# Altium schematic sheet STM32F107_207.SchDoc
size A4
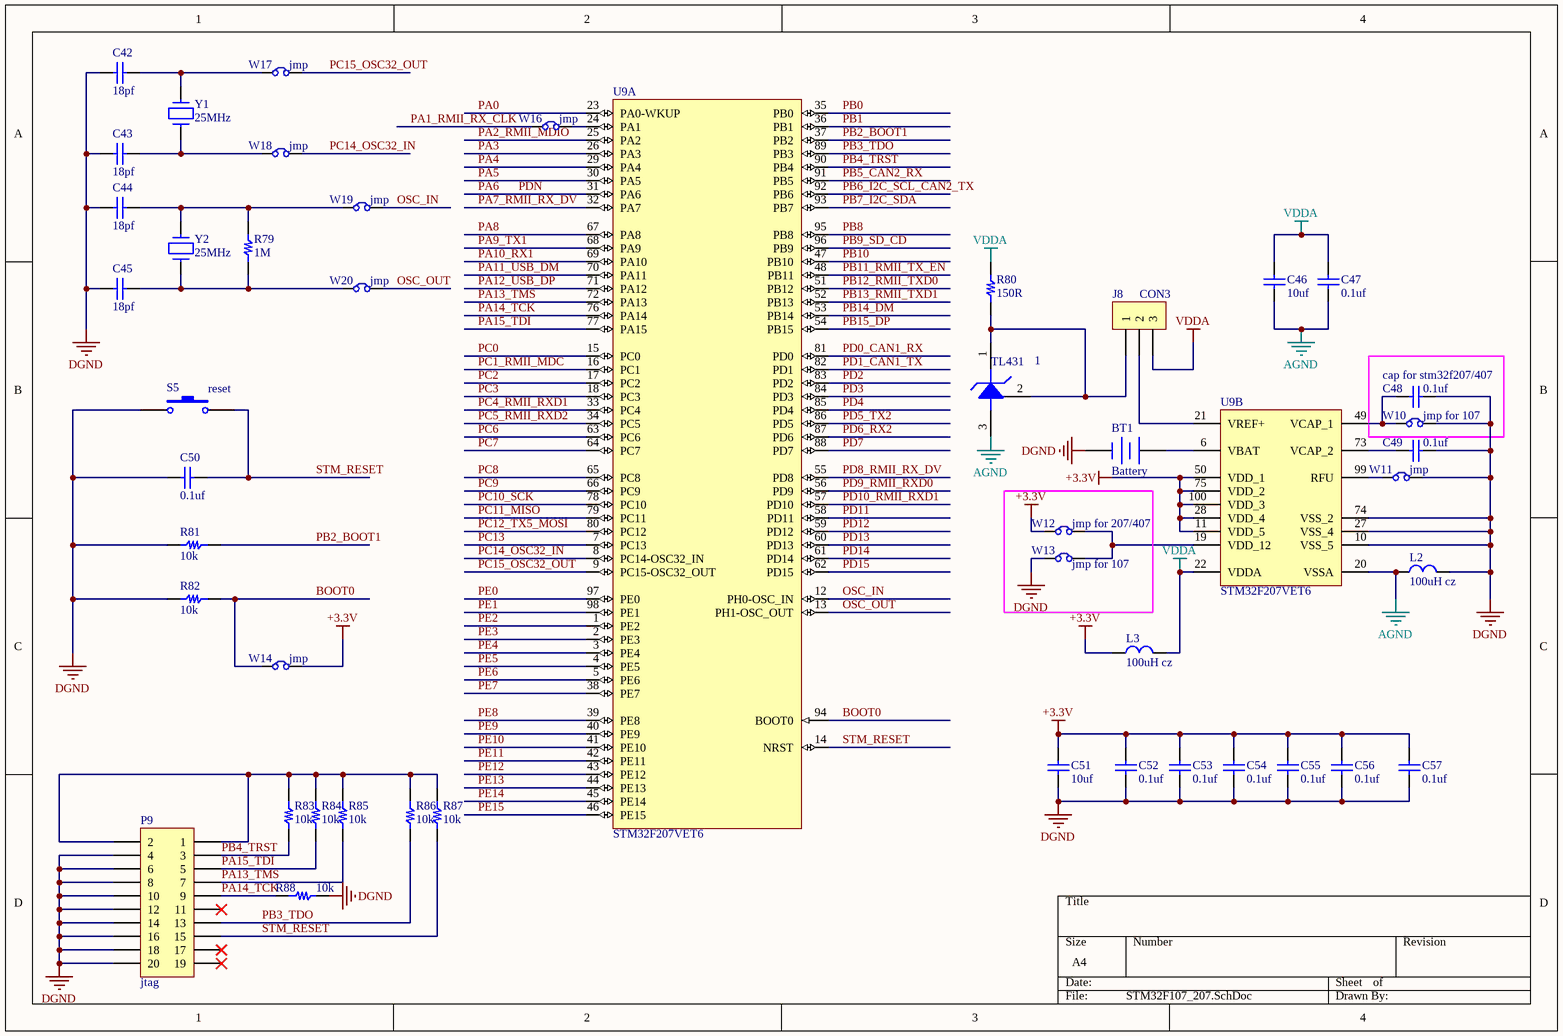
[diagram p0: STM32F107_207.SchDoc]

## Parts
1  TL431  [SOT23]
BT1  Battery  [CR1220]
C42  18pf  [0805C]
C43  18pf  [0805C]
C44  18pf  [0805C]
C45  18pf  [0805C]
C46  10uf  [0805C]
C47  0.1uf  [0805C]
C48  0.1uf  [0805C]
C49  0.1uf  [0805C]
C50  0.1uf  [0805C]
C51  10uf  [0805C]
C52  0.1uf  [0805C]
C53  0.1uf  [0805C]
C54  0.1uf  [0805C]
C55  0.1uf  [0805C]
C56  0.1uf  [0805C]
C57  0.1uf  [0805C]
J8  CON3  [sip3-2.54mm]
L2  100uH cz  [0805_SmallR]
L3  100uH cz  [0805_SmallR]
P9  jtag  [IDE20-2.54MM]
R79  1M  [0805_small]
R80  150R  [0805_small]
R81  10k  [0805_small]
R82  10k  [0805_small]
R83  10k  [0805_small]
R84  10k  [0805_small]
R85  10k  [0805_small]
R86  10k  [0805_small]
R87  10k  [0805_small]
R88  10k  [0805_small]
S5  reset  [k_TS_021]
U9  STM32F207VET6  [LQFP100_N]  (parts A,B of 2)
W10  jmp for 107  [0603_jump_Pad]
W11  jmp  [0603_jump_Pad]
W12  jmp for 207/407  [0603_jump_Pad]
W13  jmp for 107  [0603_jump_Pad]
W14  jmp  [0603_jump_Pad]
W16  jmp  [0603_jump_Pad]
W17  jmp  [0603_jump_Pad]
W18  jmp  [0603_jump_Pad]
W19  jmp  [0603_jump_Pad]
W20  jmp  [0603_jump_Pad]
Y1  25MHz  [CRY 32768-1]
Y2  25MHz  [CRYSTAL]

## Blocks framed on the sheet
cap for stm32f207/407: C48 W10

## Nets
+3.3V: C51.1 C52.1 C53.1 C54.1 C55.1 C56.1 C57.1 L3.1 U9.11(VDD_5) U9.28(VDD_4) U9.50(VDD_1) U9.75(VDD_2) U9.100(VDD_3) W12.1(C1) W14.2(C2)
AGND: 1.3(ANODE) C46.1 C47.1 L2.1 U9.20(VSSA)
DGND: BT1.2(-) C42.2 C43.2 C44.2 C45.2 C48.1 C49.1 C50.2 C51.2 C52.2 C53.2 C54.2 C55.2 C56.2 C57.2 L2.2 P9.4 P9.6 P9.8 P9.10 P9.12 P9.14 P9.16 P9.18 P9.20 R81.2 R82.2 R88.2 S5.1 U9.10(VSS_5) U9.27(VSS_4) U9.74(VSS_2) W10.2(C2) W11.2(C2) W13.1(C1)
VDDA: C46.2 C47.2 J8.3 L3.2 R80.2 U9.22(VDDA)
BOOT0: R82.1 U9.94(BOOT0) W14.1(C1)
OSC_IN: U9.12(PH0-OSC_IN) W19.2(C2)
OSC_OUT: U9.13(PH1-OSC_OUT) W20.2(C2)
PA0: U9.23(PA0-WKUP)
PA1_RMII_RX_CLK: W16.1(C1)
PA2_RMII_MDIO: U9.25(PA2)
PA3: U9.26(PA3)
PA4: U9.29(PA4)
PA5: U9.30(PA5)
PA6: U9.31(PA6)  [also labelled PDN]
PA7_RMII_RX_DV: U9.32(PA7)
PA8: U9.67(PA8)
PA9_TX1: U9.68(PA9)
PA10_RX1: U9.69(PA10)
PA11_USB_DM: U9.70(PA11)
PA12_USB_DP: U9.71(PA12)
PA13_TMS: P9.7 R85.2 U9.72(PA13)
PA14_TCK: P9.9 R88.1 U9.76(PA14)
PA15_TDI: P9.5 R84.2 U9.77(PA15)
PB0: U9.35(PB0)
PB1: U9.36(PB1)
PB2_BOOT1: R81.1 U9.37(PB2)
PB3_TDO: P9.13 R86.2 U9.89(PB3)
PB4_TRST: P9.3 R83.2 U9.90(PB4)
PB5_CAN2_RX: U9.91(PB5)
PB6_I2C_SCL_CAN2_TX: U9.92(PB6)
PB7_I2C_SDA: U9.93(PB7)
PB8: U9.95(PB8)
PB9_SD_CD: U9.96(PB9)
PB10: U9.47(PB10)
PB11_RMII_TX_EN: U9.48(PB11)
PB12_RMII_TXD0: U9.51(PB12)
PB13_RMII_TXD1: U9.52(PB13)
PB14_DM: U9.53(PB14)
PB15_DP: U9.54(PB15)
PC0: U9.15(PC0)
PC1_RMII_MDC: U9.16(PC1)
PC2: U9.17(PC2)
PC3: U9.18(PC3)
PC4_RMII_RXD1: U9.33(PC4)
PC5_RMII_RXD2: U9.34(PC5)
PC6: U9.63(PC6)
PC7: U9.64(PC7)
PC8: U9.65(PC8)
PC9: U9.66(PC9)
PC10_SCK: U9.78(PC10)
PC11_MISO: U9.79(PC11)
PC12_TX5_MOSI: U9.80(PC12)
PC13: U9.7(PC13)
PC14_OSC32_IN: U9.8(PC14-OSC32_IN) W18.2(C2)
PC15_OSC32_OUT: U9.9(PC15-OSC32_OUT) W17.2(C2)
PD0_CAN1_RX: U9.81(PD0)
PD1_CAN1_TX: U9.82(PD1)
PD2: U9.83(PD2)
PD3: U9.84(PD3)
PD4: U9.85(PD4)
PD5_TX2: U9.86(PD5)
PD6_RX2: U9.87(PD6)
PD7: U9.88(PD7)
PD8_RMII_RX_DV: U9.55(PD8)
PD9_RMII_RXD0: U9.56(PD9)
PD10_RMII_RXD1: U9.57(PD10)
PD11: U9.58(PD11)
PD12: U9.59(PD12)
PD13: U9.60(PD13)
PD14: U9.61(PD14)
PD15: U9.62(PD15)
PE0: U9.97(PE0)
PE1: U9.98(PE1)
PE2: U9.1(PE2)
PE3: U9.2(PE3)
PE4: U9.3(PE4)
PE5: U9.4(PE5)
PE6: U9.5(PE6)
PE7: U9.38(PE7)
PE8: U9.39(PE8)
PE9: U9.40(PE9)
PE10: U9.41(PE10)
PE11: U9.42(PE11)
PE12: U9.43(PE12)
PE13: U9.44(PE13)
PE14: U9.45(PE14)
PE15: U9.46(PE15)
STM_RESET: C50.1 P9.15 R87.2 S5.2 U9.14(NRST)
Net1_1: 1.1(CATHODE) 1.2(REF) J8.1 R80.1
NetBT1_1: BT1.1(+) U9.6(VBAT)
NetC42_1: C42.1 W17.1(C1) Y1.2
NetC43_1: C43.1 W18.1(C1) Y1.1
NetC44_1: C44.1 R79.2 W19.1(C1) Y2.2
NetC45_1: C45.1 R79.1 W20.1(C1) Y2.1
NetC48_2: C48.2 U9.49(VCAP_1) W10.1(C1)
NetC49_2: C49.2 U9.73(VCAP_2)
NetJ8_2: J8.2 U9.21(VREF+)
NetP9_1: P9.1 P9.2 R83.1 R84.1 R85.1 R86.1 R87.1
NetU9_19: U9.19(VDD_12) W12.2(C2) W13.2(C2)
NetU9_24: U9.24(PA1) W16.2(C2)
NetU9_99: U9.99(RFU) W11.1(C1)

Not connected (* = marked no-connect by the designer): P9 11* 17* 19*

## Library data of the parts
BT1 = Battery: Multicell Battery; Published: 24-Mar-1999; LatestRevisionDate: 17-Jul-2002; LatestRevisionNote: Re-released for DXP Platform.; PackageReference: BAT-2; Publisher: Altium Limited; PackageDescription: Battery; 2 Leads
C42-C57 = Cap: 贴片电容; Value: 100pF; Published: 8-Jun-2000; LatestRevisionDate: 17-Jul-2002; LatestRevisionNote: Re-released for DXP Platform.; PackageReference: RAD-0.3; Publisher: Altium Limited
J8 = CON3: Connector
L2 L3 = Inductor: 电感; Code_IEC: 1005; Value: 4.7uH; Published: 8-Jun-2000; LatestRevisionDate: 29-May-2009; LatestRevisionNote: IPC-7351 Footprint Added.; PackageReference: 0402-A; Publisher: Altium Limited; PackageDescription: Chip Inductor; Code_JEITA: 0402
P9 = CON10X2: Header, 10-Pin, Dual row; LatestRevisionDate: 17-Jul-2002; LatestRevisionNote: Re-released for DXP Platform.; Publisher: Altium Limited
R79-R88 = Res: 电阻; Value: 230k; Published: 24-Mar-1999; LatestRevisionDate: 29-May-2009; LatestRevisionNote: IPC-7351 Footprint Added.; PackageVersion: Mar-2003; PackageReference: 6-0805; Publisher: Altium Limited; PackageDescription: Chip Resistor 0805 Case Size; Code_IPC: RESC2012
S5 = SW-PB-2: Switch; Published: 24-Mar-1999; LatestRevisionDate: 17-Jul-2002; LatestRevisionNote: Re-released for DXP Platform.; PackageReference: SPST-2; Publisher: Altium Limited; PackageDescription: Switch; 2 Leads
U9 = STM32F207VET6: STM32 ARM-based 32-bit MCU Connectivity Line & Ethernet with 512 kB Flash, 128 kB Internal RAM, -40 to +85°C Temperature, 100-Pin LQFP, Tray; DatasheetVersion: rev6.0, Apr-2011; PackageVersion: rev13, Apr-2011; PackageReference: LQFP100; PackageDescription: 100-Pin Low-Profile Quad Flat Pack, 14 x 14 mm Body, 0.5 mm Pitch (LQFP100); ComponentLink1Description: Manufacturer URL; ComponentLink1URL: http://www.st.com/; ComponentLink2Description: STM32F205/207 Datasheet; ComponentLink2URL: http://www.st.com/internet/com/TECHNICAL_RESOURCES/TECHNICAL_LITERATURE/DATASHEET/CD00237391.pdf; ComponentLink3Description: STM32 Family Web Page; ComponentLink3URL: www.st.com/stm32
W10-W14 W16-W20 = Jumper: Jumper Wire; Published: 24-Mar-1999; LatestRevisionDate: 17-Jul-2002; LatestRevisionNote: Re-released for DXP Platform.; PackageReference: RAD-0.2; Publisher: Altium Limited; PackageDescription: Radial Cap, Thru-Hole; 2 Leads; 0.2 in Pin Spacing
Y1 Y2 = CRYSTAL: JZ; Value: 4MHz